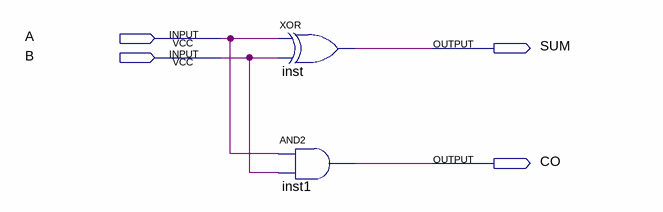
[diagram p0: schematic sheet]
// Quartus schematic half_addr.bdf as structural Verilog: 2 symbols, 4 pins
module half_addr (
  input  A,
  input  B,
  output SUM,
  output CO
);

  xor inst (SUM, A, B);
  and inst1 (CO, A, B);
endmodule
